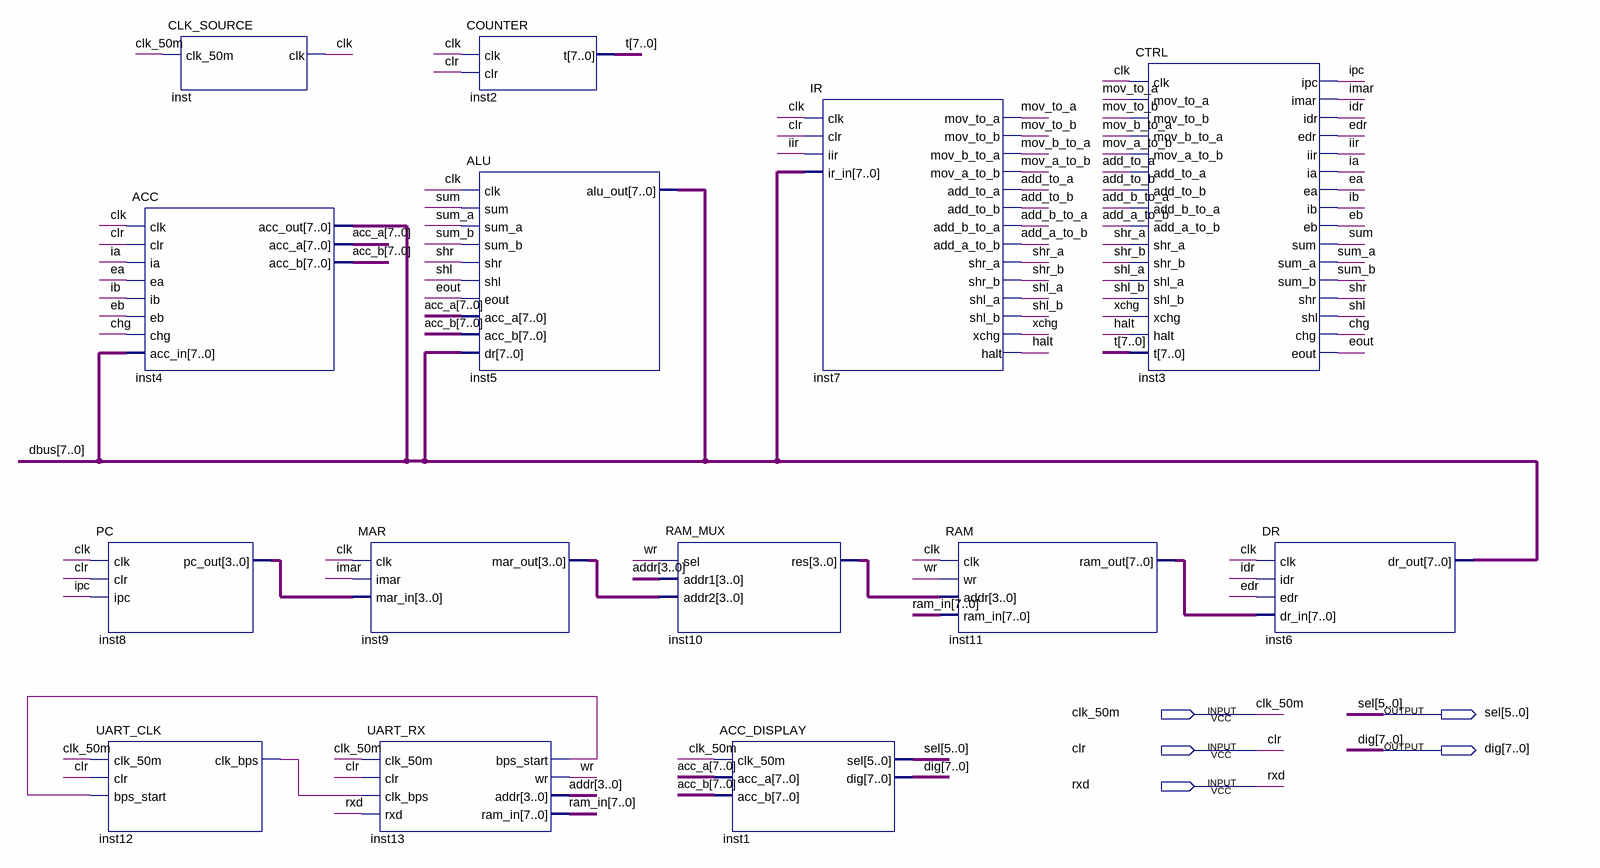
[diagram p0: schematic sheet]
// Quartus schematic AnalogCPU.bdf as structural Verilog: 14 symbols, 5 pins
module AnalogCPU (
  input  clk_50m,
  input  clr,
  input  rxd,
  output [5:0] sel,
  output [7:0] dig
);

  wire add_a_to_b, add_b_to_a, add_to_a, add_to_b, chg, clk, ea, eb, edr, eout, halt, ia, ib, idr, iir, imar,
       inst12_clk_bps, inst13_bps_start, ipc, mov_a_to_b, mov_b_to_a, mov_to_a, mov_to_b, shl, shl_a, shl_b,
       shr, shr_a, shr_b, sum, sum_a, sum_b, wr, xchg;
  wire [3:0] addr, inst8_pc_out, inst9_mar_out, inst10_res;
  wire [7:0] acc_a, acc_b, dbus, inst11_ram_out, ram_in, t;

  ACC inst4 (
    .clk(clk), .clr(clr), .ia(ia), .ea(ea), .ib(ib), .eb(eb), .chg(chg), .acc_in(dbus), .acc_out(dbus),
    .acc_a(acc_a), .acc_b(acc_b));
  PC inst8 (.clk(clk), .clr(clr), .ipc(ipc), .pc_out(inst8_pc_out));
  UART_CLK inst12 (.clk_50m(clk_50m), .clr(clr), .bps_start(inst13_bps_start), .clk_bps(inst12_clk_bps));
  CLK_SOURCE inst (.clk_50m(clk_50m), .clk(clk));
  MAR inst9 (.clk(clk), .imar(imar), .mar_in(inst8_pc_out), .mar_out(inst9_mar_out));
  UART_RX inst13 (
    .clk_50m(clk_50m), .clr(clr), .clk_bps(inst12_clk_bps), .rxd(rxd), .bps_start(inst13_bps_start), .wr(wr),
    .addr(addr), .ram_in(ram_in));
  COUNTER inst2 (.clk(clk), .clr(clr), .t(t));
  ALU inst5 (
    .clk(clk), .sum(sum), .sum_a(sum_a), .sum_b(sum_b), .shr(shr), .shl(shl), .eout(eout), .acc_a(acc_a),
    .acc_b(acc_b), .dr(dbus), .alu_out(dbus));
  RAM_MUX inst10 (.sel(wr), .addr1(addr), .addr2(inst9_mar_out), .res(inst10_res));
  ACC_DISPLAY inst1 (.clk_50m(clk_50m), .acc_a(acc_a), .acc_b(acc_b), .sel(sel), .dig(dig));
  IR inst7 (
    .clk(clk), .clr(clr), .iir(iir), .ir_in(dbus), .mov_to_a(mov_to_a), .mov_to_b(mov_to_b),
    .mov_b_to_a(mov_b_to_a), .mov_a_to_b(mov_a_to_b), .add_to_a(add_to_a), .add_to_b(add_to_b),
    .add_b_to_a(add_b_to_a), .add_a_to_b(add_a_to_b), .shr_a(shr_a), .shr_b(shr_b), .shl_a(shl_a),
    .shl_b(shl_b), .xchg(xchg), .halt(halt));
  RAM inst11 (.clk(clk), .wr(wr), .addr(inst10_res), .ram_in(ram_in), .ram_out(inst11_ram_out));
  CTRL inst3 (
    .clk(clk), .mov_to_a(mov_to_a), .mov_to_b(mov_to_b), .mov_b_to_a(mov_b_to_a), .mov_a_to_b(mov_a_to_b),
    .add_to_a(add_to_a), .add_to_b(add_to_b), .add_b_to_a(add_b_to_a), .add_a_to_b(add_a_to_b),
    .shr_a(shr_a), .shr_b(shr_b), .shl_a(shl_a), .shl_b(shl_b), .xchg(xchg), .halt(halt), .t(t), .ipc(ipc),
    .imar(imar), .idr(idr), .edr(edr), .iir(iir), .ia(ia), .ea(ea), .ib(ib), .eb(eb), .sum(sum),
    .sum_a(sum_a), .sum_b(sum_b), .shr(shr), .shl(shl), .chg(chg), .eout(eout));
  DR inst6 (.clk(clk), .idr(idr), .edr(edr), .dr_in(inst11_ram_out), .dr_out(dbus));
endmodule
